# Altium schematic sheet Pi_Ethernet_USB.SchDoc: =DocumentName
size B; DrawnBy: Cary Smith; Organization: Las Cumbres Observatoy; Address1: 6740 Cortona Dr.; Address2: Suite 102; Address3: Goleta, CA 93117; DocumentNumber: 1; Revision: 1; SheetNumber: 1; SheetTotal: 1000's
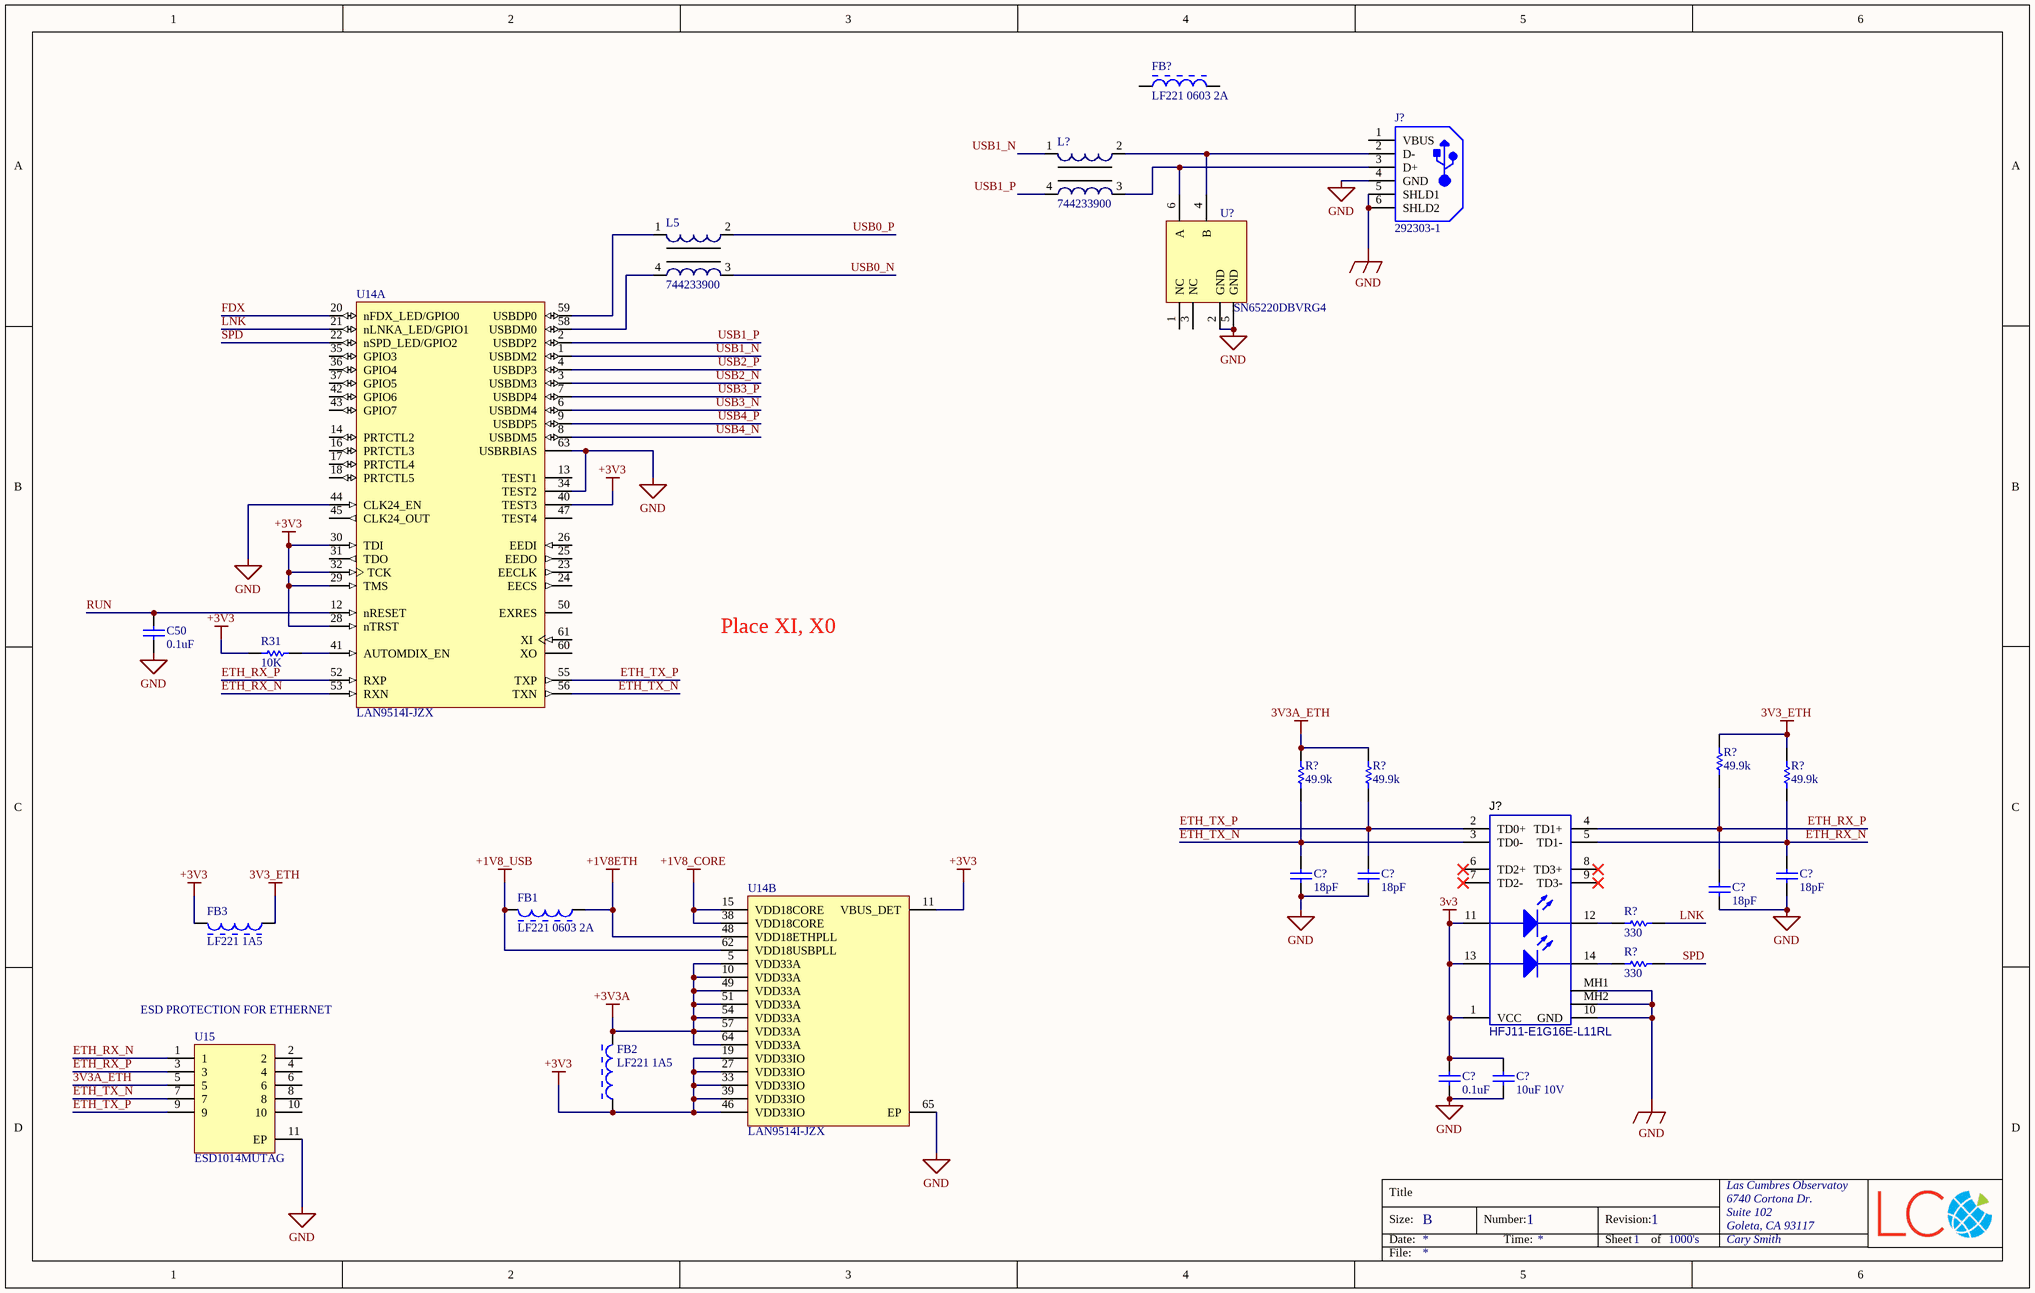
[diagram p0: Pi_Ethernet_USB.SchDoc]

## Parts
(Parts that share a designator on the sheet are numbered #1, #2 ... from top to bottom, then left to right.)
C50  0.1uF  [CAPC1005X55X25ML05T10]
C?#1  18pF  [CAPC1608X90X35NL15T15]
C?#2  18pF  [CAPC1608X90X35NL15T15]
C?#3  18pF  [CAPC1608X90X35NL15T15]
C?#4  18pF  [CAPC1608X90X35NL15T15]
C?#5  0.1uF  [CAPC1005X55X25ML05T10]
C?#6  10uF 10V  [CAPC1609X100X15LL20]
FB1  LF221 0603 2A  [MURA-BLM18-F-H1-CHIP-2_V]
FB2  LF221 1A5  [MURA-BLM15-CHIP-2_V]
FB3  LF221 1A5  [MURA-BLM15-CHIP-2_V]
FB?  LF221 0603 2A  [MURA-BLM18-F-H1-CHIP-2_V]
J?#1  292303-1  [TE-292303-1_V]
J?#2  HFJ11-E1G16E-L11RL  [HLE-HFJ11-E1G16E-L11RL_V]
L5  744233900  [WE-CNSW, 0805]
L?  744233900  [WE-CNSW, 0805]
R31  10K  [RESC1609X50X30ML10T20]
R?#1  49.9k  [RESC1609X50X30ML10T20]
R?#2  49.9k  [RESC1609X50X30ML10T20]
R?#3  49.9k  [RESC1609X50X30ML10T20]
R?#4  49.9k  [RESC1609X50X30ML10T20]
R?#5  330  [RESC1609X50X30NL10T20]
R?#6  330  [RESC1609X50X30NL10T20]
U14  LAN9514I-JZX  [MCHP-QFN-64-7300x7300TP_V]  (parts A,B of 2)
U15  ESD1014MUTAG  [ONSC-UDFN-10-517AN_V]
U?  SN65220DBVRG4  [DBV0006A_L]

## Nets
3v3: C?#5.2 C?#6.2 J?#2.1(VCC) J?#2.11 J?#2.13
3V3_ETH: FB3.1 R?#1.2 R?#4.2
3V3A_ETH: R?#2.2 R?#3.2 U15.5
+1V8_CORE: U14.15(VDD18CORE) U14.38(VDD18CORE)
+1V8_USB: FB1.2 U14.62(VDD18USBPLL)
+1V8ETH: FB1.1 U14.48(VDD18ETHPLL)
+3V3: FB2.1 FB3.2 R31.1 U14.11(VBUS_DET) U14.19(VDD33IO) U14.27(VDD33IO) U14.28(nTRST) U14.29(TMS) U14.30(TDI) U14.32(TCK) U14.33(VDD33IO) U14.39(VDD33IO) U14.40(TEST3) U14.46(VDD33IO)
+3V3A: FB2.2 U14.5(VDD33A) U14.10(VDD33A) U14.49(VDD33A) U14.51(VDD33A) U14.54(VDD33A) U14.57(VDD33A) U14.64(VDD33A)
GND: C50.2 C?#1.1 C?#2.1 C?#3.1 C?#4.1 C?#5.1 C?#6.1 J?#1.4(GND) J?#1.5(SHLD1) J?#1.6(SHLD2) J?#2.10(GND) J?#2.MH1 J?#2.MH2 U14.34(TEST2) U14.44(CLK24_EN) U14.63(USBRBIAS) U14.65(EP) U15.11(EP) U?.2(GND) U?.5(GND)
ETH_RX_N: C?#3.2 J?#2.5(TD1-) R?#4.1 U14.53(RXN) U15.1
ETH_RX_P: C?#4.2 J?#2.4(TD1+) R?#1.1 U14.52(RXP) U15.3
ETH_TX_N: C?#1.2 J?#2.3(TD0-) R?#2.1 U14.56(TXN) U15.7
ETH_TX_P: C?#2.2 J?#2.2(TD0+) R?#3.1 U14.55(TXP) U15.9
FDX: U14.20(nFDX_LED/GPIO0)
LNK: R?#5.2 U14.21(nLNKA_LED/GPIO1)
RUN: C50.1 U14.12(nRESET)
SPD: R?#6.2 U14.22(nSPD_LED/GPIO2)
USB0_N: L5.3
USB0_P: L5.2
USB1_N: L?.1 U14.1(USBDM2)
USB1_P: L?.4 U14.2(USBDP2)
USB2_N: U14.3(USBDM3)
USB2_P: U14.4(USBDP3)
USB3_N: U14.6(USBDM4)
USB3_P: U14.7(USBDP4)
USB4_N: U14.8(USBDM5)
USB4_P: U14.9(USBDP5)
NetJ?#1_2: J?#1.2(D-) L?.2 U?.4(B)
NetJ?#1_3: J?#1.3(D+) L?.3 U?.6(A)
NetJ?#2_12: J?#2.12 R?#5.1
NetJ?#2_14: J?#2.14 R?#6.1
NetL5_1: L5.1 U14.59(USBDP0)
NetL5_4: L5.4 U14.58(USBDM0)
NetR31_2: R31.2 U14.41(AUTOMDIX_EN)

Not connected (* = marked no-connect by the designer): FB? 1 2; J?#1 1(VBUS); J?#2 6(TD2+)* 7(TD2-)* 8(TD3+)* 9(TD3-)*; U14 13(TEST1) 14(PRTCTL2) 16(PRTCTL3) 17(PRTCTL4) 18(PRTCTL5) 23(EECLK) 24(EECS) 25(EEDO) 26(EEDI) 31(TDO) 35(GPIO3) 36(GPIO4) 37(GPIO5) 42(GPIO6) 43(GPIO7) 45(CLK24_OUT) 47(TEST4) 50(EXRES) 60(XO) 61(XI); U15 2 4 6 8 10; U? 1(NC) 3(NC)

## Notes on the sheet
- Place XI, X0
- (near U15) ESD PROTECTION FOR ETHERNET
- Title
- Size:
- Date:
- B
- Number:
- Time:
- Revision:
- Sheet
- of
- File:

## Library data of the parts
C50 C?#5 = CMP-2008-02013-1: VJ0402G104KXQCW1BC; Manufacturer: Vitramon; Part Number: VJ0402G104KXQCW1BC
C?#1-C?#4 = CMP-2006-04004-1: 06031A180JAT2A; Manufacturer: AVX Interconnect / Elco; Part Number: 06031A180JAT2A
C?#6 = CMP-2006-00193-1: TACL106M010XTA; Manufacturer: AVX Interconnect / Elco; Part Number: TACL106M010XTA
FB1 FB? = CMP-0686-00359-2: Chip Ferrite Bead for GHz Band General Use (Low DC Resistance Type), 220 Ohm, 2000 mA, -55 to 125 degC, 1.6 x 0.8 x 0.95 mm SMD, Tape and Reel BLM18EG221SN1J; Manufacturer: Murata; Impedance (at 100 MHz): 220 Ohm +/- 25%; DC Resistance: 0.05 Ohm Max.; Rated Current: 2000 mA; ComponentLink3Description: Package Specification; ComponentLink1Description: Manufacturer URL; PackageDescription: 2-Pin Chip, Body 1.6 x 0.8 mm; ComponentLink2URL: http://www.murata.com/products/catalog/pdf/c31e.pdf; Mounting Technology: Surface Mount; ComponentLink3URL: http://www.murata.com/products/catalog/pdf/c31e.pdf; ComponentLink1URL: http://www.murata.com/; PackageReference: BLM18_H950-2; PartNumber: BLM18EG221SN1J; Packing: Tape and Reel; DatasheetVersion: 08/2013; Operating Temperature Range: -55 to 125 degC; ComponentLink2Description: Datasheet
FB2 FB3 = CMP-0686-00268-2: Chip Ferrite Bead for Power Lines, 220 Ohm, 1400 mA, -55 to 125 degC, 1 x 0.5 x 0.55 mm SMD, Bulk BLM15PX221SN1B; Manufacturer: Murata; DC Resistance: 0.10 Ohm Max.; Impedance (at 100 MHz): 220 Ohm +/- 25%; Rated Current: 1400 mA; DatasheetVersion: 08/2013; ComponentLink2URL: http://www.murata.com/products/catalog/pdf/c31e.pdf; Packing: Bulk; PartNumber: BLM15PX221SN1B; Mounting Technology: Surface Mount; ComponentLink1Description: Manufacturer URL; Operating Temperature Range: -55 to 125 degC; ComponentLink1URL: http://www.murata.com/; PackageReference: BLM15-2; PackageDescription: 2-Pin Chip, Body 1 x 0.5 mm; ComponentLink3Description: Package Specification; ComponentLink2Description: Datasheet; ComponentLink3URL: http://www.murata.com/products/catalog/pdf/c31e.pdf
J?#1 = CMP-2000-05404-1: 1 Port Right Angle Through Hole Mount Female Type A USB Connector, 4 Position, -55 to 85 degC, RoHS, Tube; Manufacturer: TE Connectivity; Contact Termination Type: Solder; No. of Contacts: 4; Connector Mounting: PCB; SVHC: NoSVHC(16-Jun-2014); Gender: Receptacle; Connector Type: USBA; Package Description: 4-Pin Through Hole Device, Body 14 x 13.13 mm, Pitch 2.5 mm; Contact Plating: Gold; Package Reference: 292303-1; Contact Material: Copper; Datasheet URL: http://www.farnell.com/cad/1653030.pdf; Datasheet Version: Feb-12; Manufacturer URL: http://www.te.com/
J?#2 = CMP-1531-00001-1: FastJack™ 1x1 Tab-Down Gigabit Short Body RJ45, IEEE802.3ab Compliant, -40 to 85 degC, 14-Pin 21.59 x 15.88 x 13.64 mm THD, RoHS; Manufacturer: HALO Electronics; Return Loss@60 MHz: -14 dB Min.; Speed: 10/100/1000BASE-T; PartNumber: HFJ11-E1G16E-L11RL; ComponentLink3URL: http://www.haloelectronics.com/pdf/fastjack-gigabit.pdf; Mounting Technology: Through Hole; ComponentLink1URL: www.haloelectronics.com/; RoHS: TRUE; ComponentLink2Description: Datasheet; DatasheetVersion: 04/2014; ComponentLink2URL: http://www.haloelectronics.com/pdf/fastjack-gigabit.pdf; Temperature Range: -40 to 85 degC; Latch: Tab-Down; Standard: IEEE802.3ab; ComponentLink3Description: Package Specification; PackageDescription: FastJack Gigabit Ethernet RJ45, Body 21.59 x 15.88 mm, Height 15.64 mm; ComponentLink1Description: Manufacturer URL; ComponentLink4Description: A Beginner's Guide to Ethernet 802.3; ComponentLink4URL: https://www.analog.com/media/en/technical-documentation/application-notes/EE-269.pdf
L5 L? = CMP-1373-00002-1: SMD Common Mode Noise Suppressor WE-CNSW HF,  Z= 90 Ohm; Manufacturer: Wuerth Elektronik; Impedance: 90 Ohm; PartNumber: 744233900; ComponentLink2Description: Datasheet; ComponentLink2URL: http://www.we-online.de/katalog/media/pdf/744233900.pdf; ComponentLink1Description: Manufacturer URL; PackageReference: WE-CNSW, 0805; ComponentLink1URL: http://www.we-online.com
R31 = CMP-2000-03838-1: CRCW060310K0JNEA; Manufacturer: Vishay Dale; Part Number: CRCW060310K0JNEA
R?#1-R?#4 = CMP-2000-03396-1: CRCW060349R9FKEA; Manufacturer: Vishay Dale; Part Number: CRCW060349R9FKEA
R?#5 R?#6 = CMP-2000-03239-1: CRCW0603330RFKEA; Manufacturer: Vishay Dale; Part Number: CRCW0603330RFKEA
U14 = CMP-1537-00003-1: USB 2.0 Hub and 10/100 Ethernet Controller, 3.3 V, -40 to 85 degC, 64-Pin QFN, RoHS, Tray; Manufacturer: Microchip; Interface: USB 2.0; Supply Voltage: 3.3 V; Downstreamm USB Ports: 4; DatasheetVersion: Rev. 1.2; RoHS: TRUE; ComponentLink1URL: www.microchip.com/; ComponentLink3Description: Package Specification; PartNumber: LAN9514I-JZX; ComponentLink1Description: Manufacturer URL; ComponentLink2URL: http://ww1.microchip.com/downloads/en/DeviceDoc/9514.pdf; Mounting Technology: Surface Mount; ComponentLink2Description: Datasheet; ComponentLink3URL: http://ww1.microchip.com/downloads/en/DeviceDoc/9514.pdf; Temperature Range: -40 to 85 degC; PackageDescription: 64-Pin Quad Flat Non-Leaded Package, Body 9 x 9 mm, Pitch 0.5 mm; Packing: Tray
U15 = CMP-1063-00241-1: Low Capacitance ESD Protection Array for High Speed Data Lines Protection, 10-Pin UDFN, Pb-Free, Tape and Reel; Manufacturer: On Semiconductor; V(BR) Min (V): 5; Direction: Bidirectional; VRWM Max (V): 3.3; Number of Lines: 4; PPK Max (W): 450; PackageVersion: Rev. B, 10/2012; PackageDescription: 10-Pin Small Outline No-Lead, Body 2.6 x 2.6 mm, Pitch 0.5 mm; RoHS: Pb-Free; PackageReference: UDFN-10-517AN; ComponentLink3URL: http://www.onsemi.cn/pub_link/Collateral/517AN.PDF; Packing: Tape and Reel; DatasheetVersion: Rev. 5; ComponentLink1Description: Manufacturer URL; ComponentLink1URL: http://www.onsemi.com/; ComponentLink3Description: Package Specification; ComponentLink2Description: Datasheet; IR Max (uA): 5; ComponentLink2URL: http://www.onsemi.cn/pub_link/Collateral/ESD1014-D.PDF; Mounting Technology: Surface Mount; PartNumber: ESD1014MUTAG
U? = CMP-0326-00060-2: Single Universal Serial Bus Port Transient Suppressor, 2 Channels, -40 to +85 degC, 6-pin SOT-23 (DBV), Green (RoHS & no Sb/Br); Manufacturer: Texas Instruments; IO Leakage Current(nA): 1000; Breakdown Voltage(Min)(V): 7; IO Capacitance(Typ)(pF): 35; USB Full Speed: TRUE; SubFamily: ESD Solution; ComponentLink1Description: Manufacturer URL; Eco-Plan: Green (RoHS & no Sb/Br); ComponentLink2URL: http://www.ti.com/general/docs/lit/getliterature.tsp?genericPartNumber=SN65220&fileType=pdf; PackageReference: DBV0006A; PackageDescription: 6-Pin Plastic Small-Outline Package, 2.9 x 1.6 mm Body, 0.95 mm Pitch, 2.8 mm Lead Span; PartNumber: SN65220DBVRG4; PackageVersion: revK, Mar-2006; ComponentLink1URL: http://www.ti.com/; ComponentLink2Description: Datasheet; Mounting Technology: Surface Mount; ComponentLink3URL: SamplesURL:http://www.ti.com/product/sn65220#samples; DatasheetVersion: SLLS266G; ComponentLink3Description: URL Link1